# Altium schematic sheet Schematic_Rev2.SchDoc: ESP32 Stock Ticker
size Tabloid; DrawnBy: MR; Address1: @mikerankin; Revision: 2; SheetNumber: 1; SheetTotal: 1
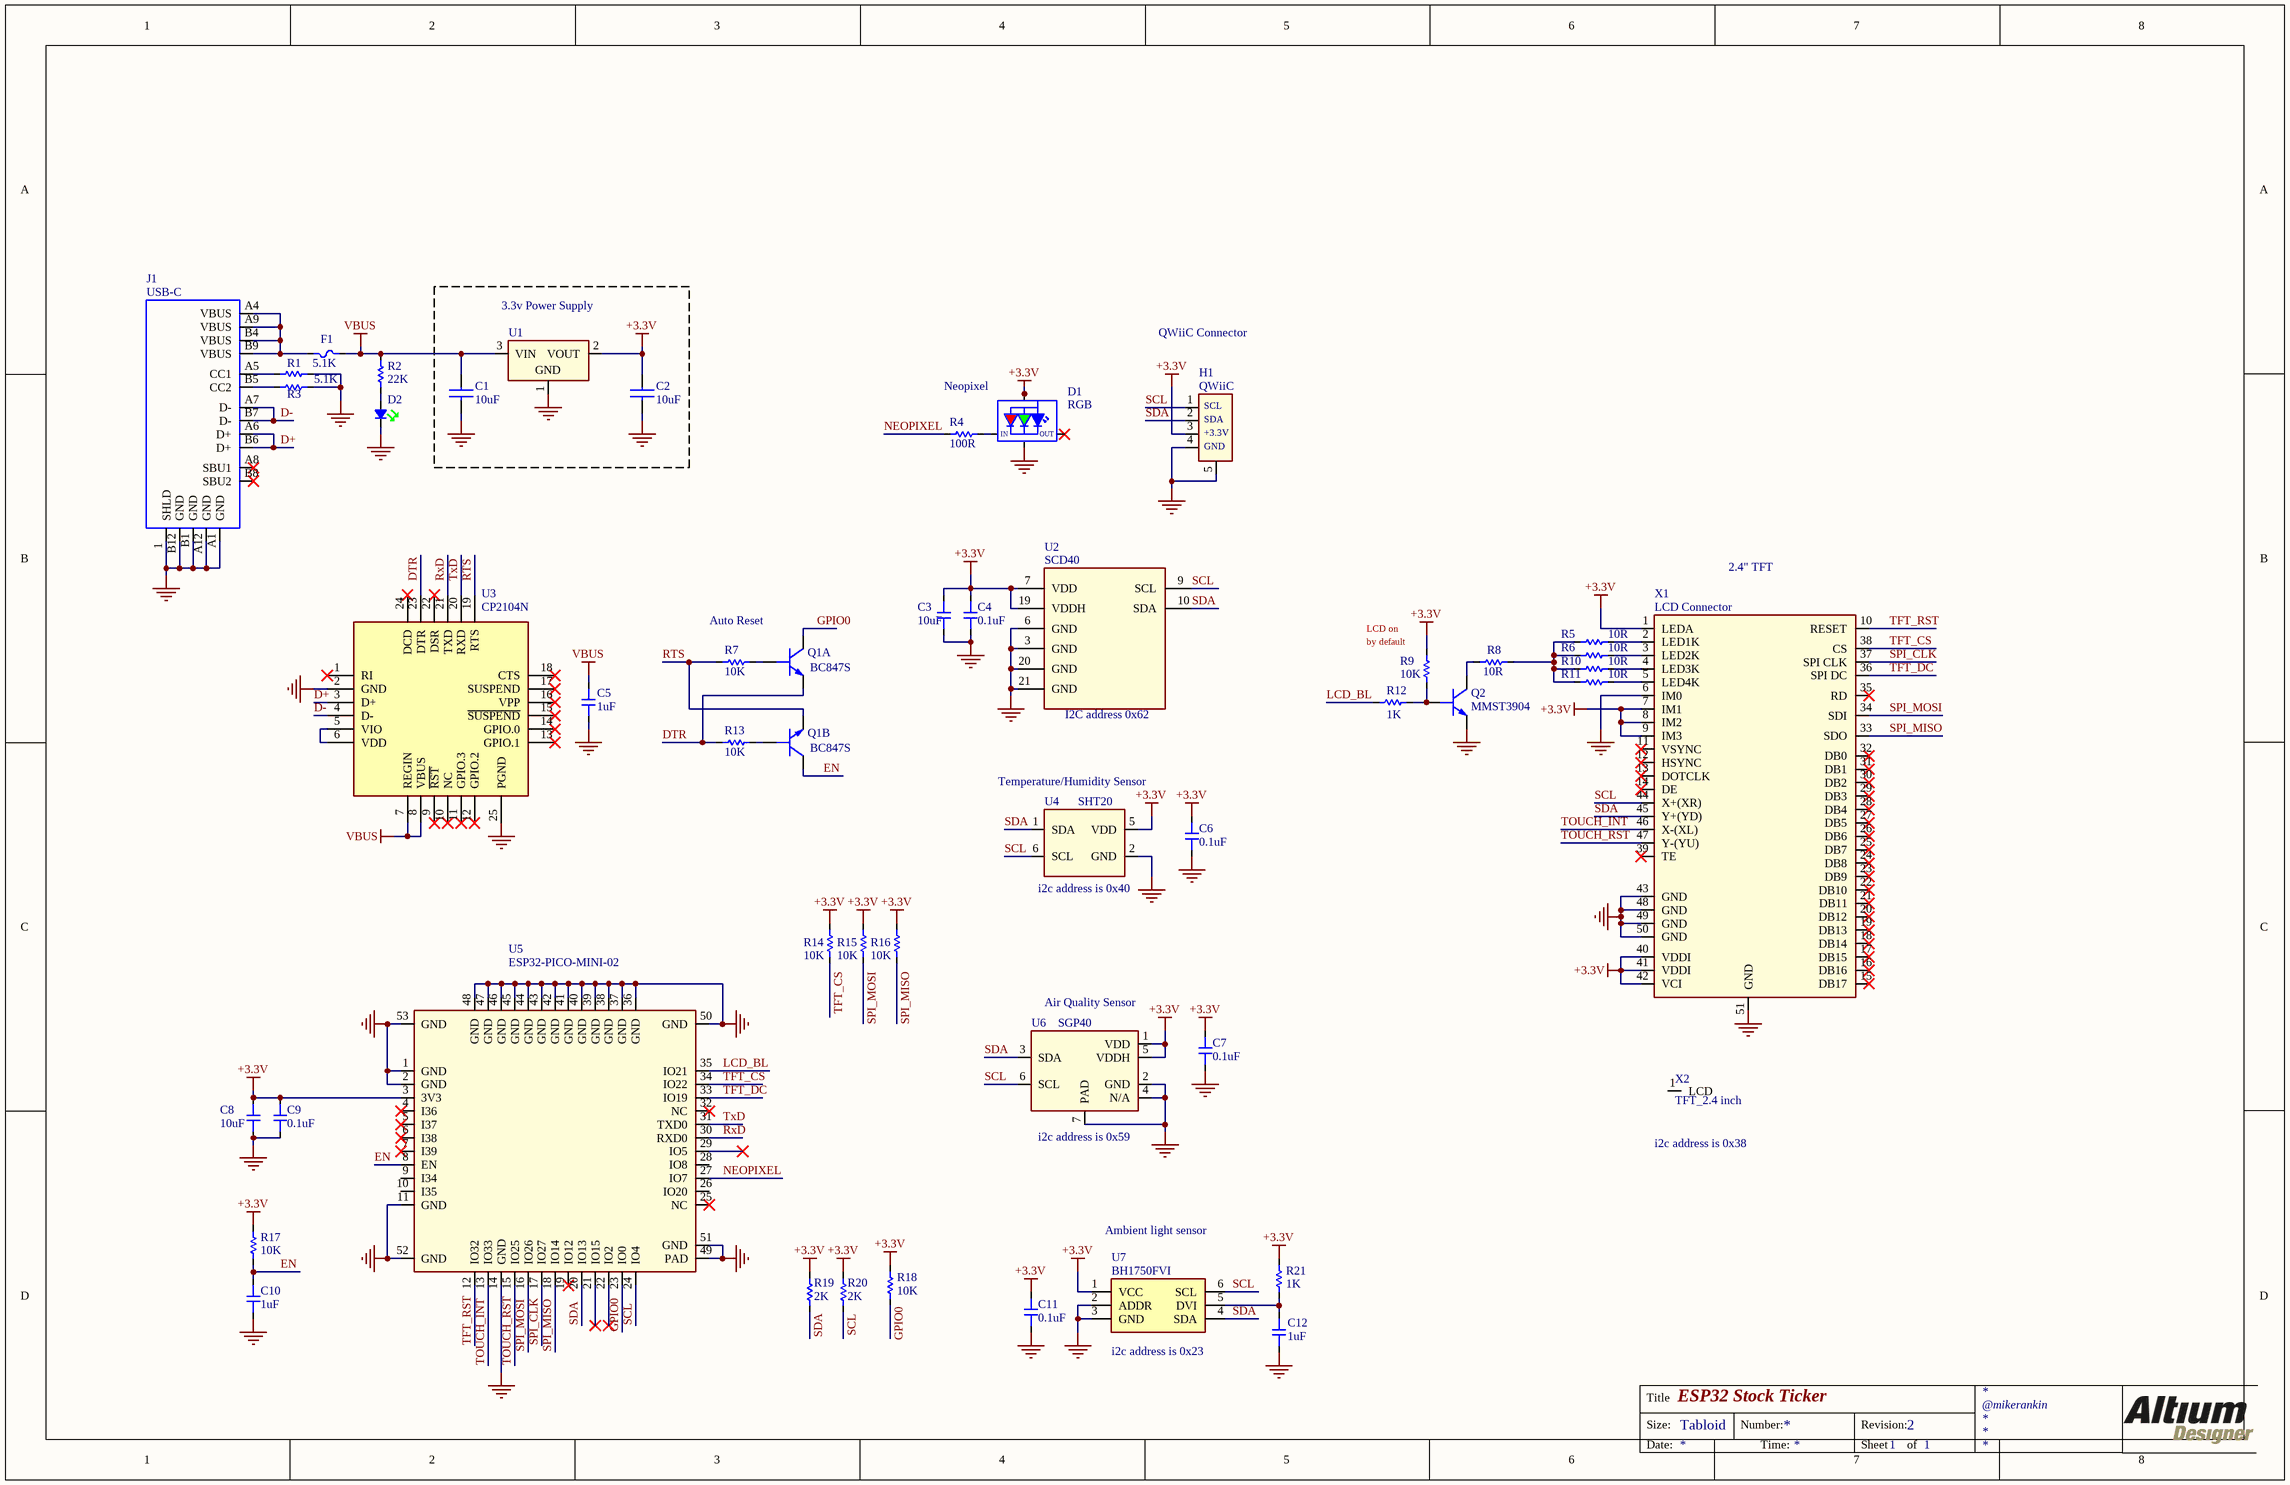
[diagram p0: Schematic_Rev2.SchDoc]

## Parts
C1  10uF  [CAPC2012X140N]
C2  10uF  [CAPC2012X140N]
C3  10uF  [CAPC2012X140N]
C4  0.1uF  [CAPC1608X09L]
C5  1uF  [CAPC1005X56N]
C6  0.1uF  [CAPC1005X56N]
C7  0.1uF  [CAPC1005X56N]
C8  10uF  [CAPC2012X140N]
C9  0.1uF  [CAPC1608X09L]
C10  1uF  [CAPC1005X56N]
C11  0.1uF  [CAPC1005X56N]
C12  1uF  [CAPC1005X56N]
D1  RGB  [SK6805-EC14]
D2  Green Led  [LED1005X40N-Green]  (value not drawn)
F1  TLC-PSMD050  [PTC2012X70L]  (value not drawn)
H1  QWiiC  [SM04B-SRSS-TB]
J1  USB-C  [TYPE-C-31-M-12]
Q1  BC847S  [SOT65P210X110-6N]  (parts A,B of 2)
Q2  MMST3904  [SC-70]
R1  5.1K  [RESC1005X40L (0402 FOOTPRINT)]
R2  22K  [RESC1005X40L (0402 FOOTPRINT)]
R3  5.1K  [RESC1005X40L (0402 FOOTPRINT)]
R4  100R  [RESC1005X40L (0402 FOOTPRINT)]
R5  10R  [RESC1005X40L (0402 FOOTPRINT)]
R6  10R  [RESC1005X40L (0402 FOOTPRINT)]
R7  10K  [RESC1005X40L (0402 FOOTPRINT)]
R8  10R  [RESC1005X40L (0402 FOOTPRINT)]
R9  10K  [RESC1005X40L (0402 FOOTPRINT)]
R10  10R  [RESC1005X40L (0402 FOOTPRINT)]
R11  10R  [RESC1005X40L (0402 FOOTPRINT)]
R12  1K  [RESC1005X40L (0402 FOOTPRINT)]
R13  10K  [RESC1005X40L (0402 FOOTPRINT)]
R14  10K  [RESC1005X40L (0402 FOOTPRINT)]
R15  10K  [RESC1005X40L (0402 FOOTPRINT)]
R16  10K  [RESC1005X40L (0402 FOOTPRINT)]
R17  10K  [RESC1005X40L (0402 FOOTPRINT)]
R18  10K  [RESC1005X40L (0402 FOOTPRINT)]
R19  2K  [RESC1005X40L (0402 FOOTPRINT)]
R20  2K  [RESC1005X40L (0402 FOOTPRINT)]
R21  1K  [RESC1005X40L (0402 FOOTPRINT)]
U1  NCP1117LPST33T3G  [SOT230P700X180-4N]  (value not drawn)
U2  SCD40  [SCD40]
U3  CP2104N  [24-QFN]
U4  SHT20  [DFN-6 (3mm X 3mm)]
U5  ESP32-PICO-MINI-02  [ESP32-PICO-MINI-02]
U6  SGP40  [DFN-6 (2.45mm X 2.45mm)]
U7  BH1750FVI  [WSOF-6]
X1  LCD Connector  [ER-CON50HT]
X2  TFT_2.4 inch

## Blocks framed on the sheet
3.3v Power Supply: C1 C2 U1

## Nets
+3.3V: C2.1 C3.1 C4.1 C6.1 C7.1 C8.1 C9.1 C11.1 D1.1(VDD) H1.3 R9.1 R14.1 R15.1 R16.1 R17.2 R18.2 R19.1 R20.1 R21.2 U1.2(VOUT) U2.7(VDD) U2.19(VDDH) U4.5(VDD) U5.3(3V3) U6.1(VDD) U6.5(VDDH) U7.1(VCC) X1.1(LEDA) X1.7(IM1) X1.8(IM2) X1.9(IM3) X1.40(VDDI) X1.41(VDDI) X1.42(VCI)
GND: C1.2 C2.2 C3.2 C4.2 C5.1 C6.2 C7.2 C8.2 C9.2 C10.2 C11.2 C12.1 D1.3(GND) D2.1 H1.4 H1.5 J1.1(SHLD) J1.A1(GND) J1.A12(GND) J1.B1(GND) J1.B12(GND) Q2.2(E) R1.2 R3.2 U1.1(GND) U2.3(GND) U2.6(GND) U2.20(GND) U2.21(GND) U3.2(GND) U3.25(PGND) U4.2(GND) U5.1(GND) U5.2(GND) U5.11(GND) U5.14(GND) U5.36(GND) U5.37(GND) U5.38(GND) U5.39(GND) U5.40(GND) U5.41(GND) U5.42(GND) U5.43(GND) U5.44(GND) U5.45(GND) U5.46(GND) U5.47(GND) U5.48(GND) U5.49(PAD) U5.50(GND) U5.51(GND) U5.52(GND) U5.53(GND) U6.2(GND) U6.4(N/A) U6.7(PAD) U7.2(ADDR) U7.3(GND) X1.6(IM0) X1.43(GND) X1.48(GND) X1.49(GND) X1.50(GND) X1.51(GND)
VBUS: C1.1 C5.2 F1.1 R2.2 U1.3(VIN) U3.7(REGIN) U3.8(VBUS)
D+: J1.A6(D+) J1.B6(D+) U3.3(D+)
D-: J1.A7(D-) J1.B7(D-) U3.4(D-)
DTR: Q1.1(E1) R13.2 U3.23(DTR)
EN: C10.1 Q1.3(C2) R17.1 U5.8(EN)
GPIO0: Q1.6(C1) R18.1 U5.23(IO0)
LCD_BL: R12.2 U5.35(IO21)
NEOPIXEL: R4.2 U5.27(IO7)
RTS: Q1.4(E2) R7.2 U3.19(RTS)
RxD: U3.21(TXD) U5.30(RXD0)
SCL: H1.1 R20.2 U2.9(SCL) U4.6(SCL) U5.24(IO4) U6.6(SCL) U7.6(SCL) X1.44(X+(XR))
SDA: H1.2 R19.2 U2.10(SDA) U4.1(SDA) U5.20(IO13) U6.3(SDA) U7.4(SDA) X1.45(Y+(YD))
SPI_CLK: U5.17(IO27) X1.37(SPI_CLK)
SPI_MISO: R16.2 U5.18(IO14) X1.33(SDO)
SPI_MOSI: R15.2 U5.16(IO26) X1.34(SDI)
TFT_CS: R14.2 U5.34(IO22) X1.38(CS)
TFT_DC: U5.33(IO19) X1.36(SPI_DC)
TFT_RST: U5.12(IO32) X1.10(RESET)
TOUCH_INT: U5.13(IO33) X1.46(X-(XL))
TOUCH_RST: U5.15(IO25) X1.47(Y-(YU))
TxD: U3.20(RXD) U5.31(TXD0)
NetC12_2: C12.2 R21.1 U7.5(DVI)
NetD1_4: D1.4(DIN) R4.1
NetD2_2: D2.2 R2.1
NetF1_2: F1.2 J1.A4(VBUS) J1.A9(VBUS) J1.B4(VBUS) J1.B9(VBUS)
NetJ1_A5: J1.A5(CC1) R1.1
NetJ1_B5: J1.B5(CC2) R3.1
NetQ1_2: Q1.2(B1) R7.1
NetQ1_5: Q1.5(B2) R13.1
NetQ2_1: Q2.1(B) R9.2 R12.1
NetQ2_3: Q2.3(C) R8.2
NetR5_1: R5.1 X1.2(LED1K)
NetR5_2: R5.2 R6.2 R8.1 R10.2 R11.2
NetR6_1: R6.1 X1.3(LED2K)
NetR10_1: R10.1 X1.4(LED3K)
NetR11_1: R11.1 X1.5(LED4K)
NetU3_5: U3.5(VIO) U3.6(VDD)

Not connected (* = marked no-connect by the designer): D1 2(DOUT)*; J1 A8(SBU1)* B8(SBU2)*; U3 1(RI)* 9(~{RST})* 10(NC)* 11(GPIO.3)* 12(GPIO.2)* 13(GPIO.1)* 14(GPIO.0)* 15(~{SUSPEND})* 16(VPP)* 17(SUSPEND)* 18(CTS)* 22(DSR)* 24(DCD)*; U5 4(I36)* 5(I37)* 6(I38)* 7(I39)* 9(I34) 10(I35) 19(IO12)* 21(IO15)* 22(IO2)* 25(NC)* 26(IO20) 28(IO8) 29(IO5)* 32(NC)*; X1 11(VSYNC)* 12(HSYNC)* 13(DOTCLK)* 14(DE)* 15(DB17)* 16(DB16)* 17(DB15)* 18(DB14)* 19(DB13)* 20(DB12)* 21(DB11)* 22(DB10)* 23(DB9)* 24(DB8)* 25(DB7)* 26(DB6)* 27(DB5)* 28(DB4)* 29(DB3)* 30(DB2)* 31(DB1)* 32(DB0)* 35(RD)* 39(TE)*; X2 1(LCD)

## Notes on the sheet
- QWiiC Connector
- (near D1) Neopixel
- 2.4" TFT
- Auto Reset
- (near R9) LCD on
- (near R9) by default
- (near U2) I2C address 0x62
- Temperature/Humidity Sensor
- (near U4) i2c address is 0x40
- (near U6) Air Quality Sensor
- (near U6) i2c address is 0x59
- (near X2) i2c address is 0x38
- Ambient light sensor
- (near U7) i2c address is 0x23
- Title
- Size:
- Tabloid
- Number:
- Revision:
- Date:
- Time:
- Sheet
- of
- (in symbol SK6805-EC14) IN; OUT
- (in symbol SM04B-SRSS-TB) SCL; SDA; +3.3V; GND

## Library data of the parts
C1 C2 = CAP_0805: CAP 10uF 16V 0805; Part_Number: C162317; Manufacturer: Murata; Part_Footprint: 0805; Vendor: LCSC; Value: 10uF
C3 = CAP_0805: CAP 10uF 50V 0805; Part_Footprint: 0805; Value: 10uF
C4 C9 = CAP_0603: CAP 0.1uF 0603; Part_Footprint: 0603; Value: 0.1uF
C5 C10 C12 = CAP_0402: CAP 1uF 0402; Part_Footprint: 0402; Value: 1uF
C6 C7 C11 = CAP_0402: CAP 0.1uF 0402; Part_Footprint: 0402; Value: 0.1uF
C8 = CAP_0805: CAP 10uF 0805; Part_Footprint: 0805; Value: 10uF
D1 = SK6805-EC14: LED,RGB,NEOPIXEL,SK6805-EC14; Part_Number: C2909055; Manufacturer: OPSCO; Vendor: LCSC; Part_Footprint: SMD-1414; Value: NeoPixel
D2 = LED_0402_SMALL_GREEN: LED Green 0402; Part_Number: C74338; Part_Footprint: 0402; Vendor: LCSC; Value: Green Led
F1 = PTC_FUSE: PTC FUSE 500mA hold, 1A trip 0805 SMD; Manufacturer: TLC; Vendor: LCSC; LCSC_Part_Number: C261942; Value: TLC-PSMD050; Part_Number: TLC-PSMD050
H1 = SM04B-SRSS-TB: CONN HEADER 4POS .100 R/A QWIIC; Manufacturer: JST; Part_Number: SM04B-SRSS-TB(LF)(SN); Vendor: Digi-Key; Value: QWiiC
J1 = USB-C: CONN RECPT USB-C; Manufacturer: KHE; Part_Number: C165948; Part_Footprint: SMT; Vendor: LCSC; Value: USB-C
Q1 = BC847S: TRANS 2NPN 44V 0.1A SC-70-6; Manufacturer: Changjiang; Vendor: LCSC; Part_Number: BC847S; Value: 2NPN
Q2 = MMST3904: TRANSISTOR NPN GP 40V SC-70; Manufacturer: Changjiang; Part_Number: C54879; Vendor: LCSC; Part_Footprint: SC-70; Value: MMST3904
R1 R3 = RES_0603: RES 5.1K 0402; Vendor: LCSC; Value: 5.1K
R2 = RES_0603: RES 22K 0402; Manufacturer: LIZ Elec; Part_Number: C100310; Vendor: LCSC; Value: 22K
R4 = RES_0402: RES 100R 0402; Part_Footprint: 0402; Value: 100R
R5 R6 R10 R11 = RES_0402: RES 10R 0402; Part_Footprint: 0402; Vendor: LCSC; Value: 10R
R7 R9 R13-R18 = RES_0402: RES 10K 0402; Part_Footprint: 0402; Value: 10K
R8 = RES_0402: RES 10R 0402; Part_Footprint: 0402; Value: 10R
R12 R21 = RES_0402: RES 1K 0402; Part_Footprint: 0402; Value: 1K
R19 R20 = RES_0402: RES 2K 0402; Part_Footprint: 0402; Value: 2K
U1 = NCP1117LPST33T3G: IC REG LDO 3.3V 1A SOT223-3; Manufacturer: ON Semi; Vendor: LCSC; Value: 3.3V 1A LDO; Part_Number: NCP1117LPST33T3G
U2 = SCD40: CO2 SENSOR 50 PPM I2C SMD; Manufacturer: Sensirion; Part_Number: SCD40; Part_Footprint: SCD40; Value: SCD40
U3 = CP2104N: IC BRIDGE USB TO UART 24QFN; Manufacturer: Silicon Labs; Part_Number: C47742; Vendor: LCSC; Part_Footprint: 24QFN; Value: CP2104N
U4 = SHT20: SENSOR HUMID/TEMP 3V I2C 3% SMD; Manufacturer: Sensirion AG; Part_Footprint: 6-DFN; Vendor: Digi-Key; Part_Number: SHT20; Value: SHT20
U5 = ESP32-PICO-MINI-02: WIFI/Bluetooth, Mini Module; Manufacturer: Espressif; Part_Footprint: Mini Module; Value: ESP32-PICO-MINI-02
U6 = SGP40: AIR QUALITY GAS SENSOR FOR VOC'S; Manufacturer: Sensirion AG; Part_Footprint: 6-DFN; Part_Number: SGP40-D-R4; Vendor: Digi-Key; Value: SGP40
U7 = BH1750FVI: Optical Sensor Ambient I2C 6-SMD; Manufacturer: Rohm; Part_Footprint: 6WSOF; Part_Number: C78960; Vendor: LCSC; Value: BH1750FVI
X1 = FFC, FPC 50 pin 0.5mm Con 2.4" TFT: FFC, FPC 50 pin 0.5mm Connector for 2.4" TFT; Part_Number: C397332; Manufacturer: XKB; Part_Footprint: SMD; Vendor: LCSC; Value: LCD Connector
X2 = TFT_GLASS 2.4 INCH COLOR: 2.4 INCH TFT GLASS COLOR; Part_Number: ER-TFT024-3; Manufacturer: BuyDisplay.com; Vendor: BuyDisplay; Value: *